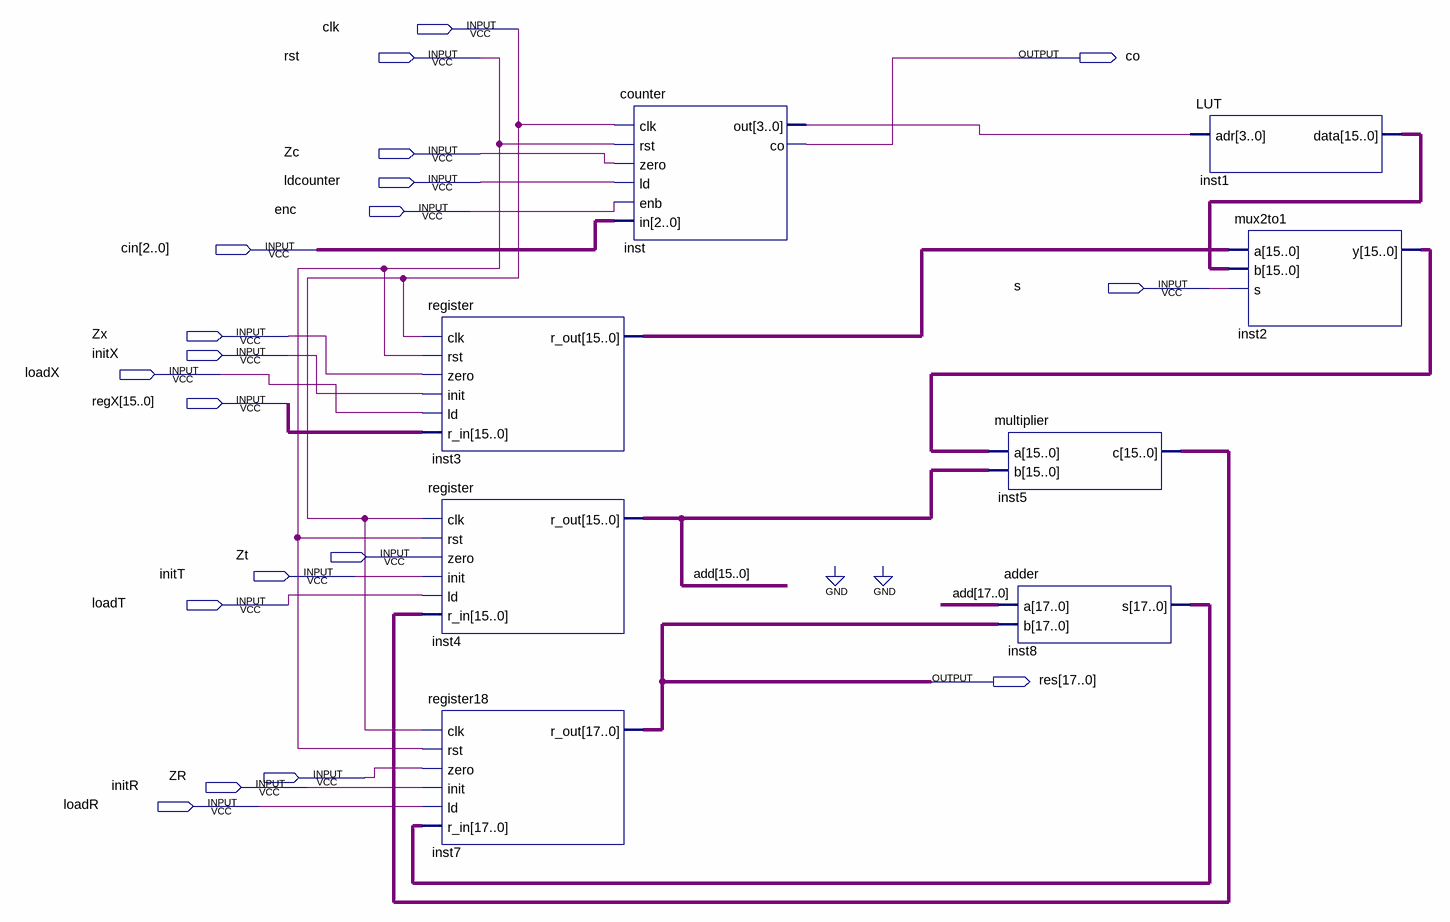
[diagram p0: schematic sheet]
// Quartus schematic Block1.bdf as structural Verilog: 8 symbols, 19 pins
module Block1 (
  input  clk,
  input  rst,
  input  Zc,
  input  ldcounter,
  input  enc,
  input  [2:0] cin,
  input  s,
  input  Zx,
  input  initX,
  input  loadX,
  input  [15:0] regX,
  input  Zt,
  input  initT,
  input  loadT,
  input  ZR,
  input  initR,
  input  loadR,
  output co,
  output [17:0] res
);

  wire [3:0] inst_out;
  wire [15:0] inst1_data, inst2_y, inst3_r_out, inst5_c;
  wire [17:0] add, inst8_s;

  register inst3 (.clk(clk), .rst(rst), .zero(Zx), .init(initX), .ld(loadX), .r_in(regX), .r_out(inst3_r_out));
  register inst4 (.clk(clk), .rst(rst), .init(initT), .ld(loadT), .r_in(inst5_c), .r_out(add[15:0]));  // open: zero
  register18 inst7 (.clk(clk), .rst(rst), .zero(ZR), .init(initR), .ld(loadR), .r_in(inst8_s), .r_out(res));
  counter inst (.clk(clk), .rst(rst), .zero(Zc), .ld(ldcounter), .enb(enc), .in(cin), .out(inst_out), .co(co));
  multiplier inst5 (.a(inst2_y), .b(add[15:0]), .c(inst5_c));
  adder inst8 (.a(add), .b(res), .s(inst8_s));
  LUT inst1 (.adr(inst_out), .data(inst1_data));
  mux2to1 inst2 (.a(inst3_r_out), .b(inst1_data), .s(s), .y(inst2_y));
endmodule
